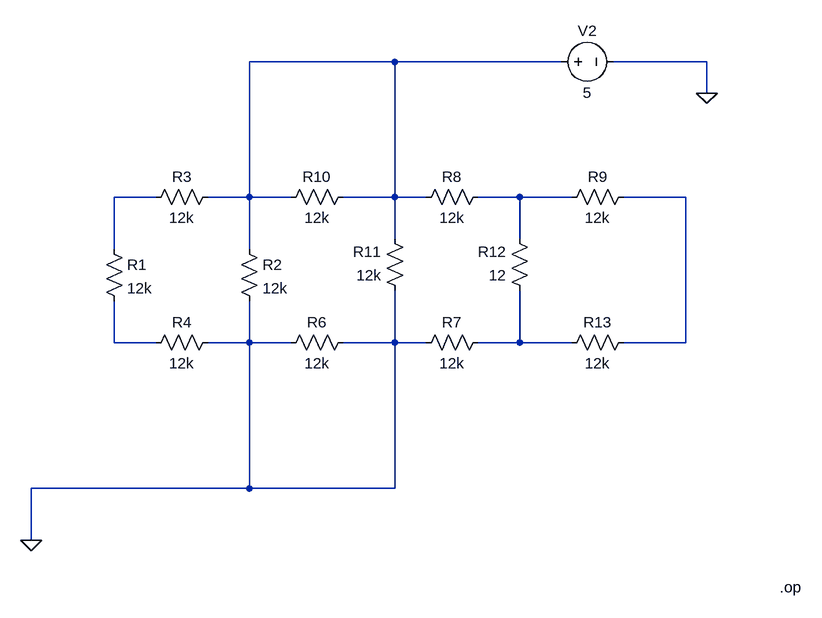
[diagram p0: schematic Experiment 0 Circuit Analysis.asc]
Experiment 0 Circuit Analysis.asc, the LTspice schematic file:
Version 4
SHEET 1 2708 808
WIRE 688 -16 464 -16
WIRE 944 -16 688 -16
WIRE 1168 -16 1024 -16
WIRE 1168 32 1168 -16
WIRE 320 192 256 192
WIRE 464 192 464 -16
WIRE 464 192 400 192
WIRE 528 192 464 192
WIRE 688 192 688 -16
WIRE 688 192 608 192
WIRE 736 192 688 192
WIRE 880 192 816 192
WIRE 960 192 880 192
WIRE 1136 192 1040 192
WIRE 688 256 688 192
WIRE 880 256 880 192
WIRE 256 272 256 192
WIRE 464 272 464 192
WIRE 256 416 256 352
WIRE 320 416 256 416
WIRE 464 416 464 352
WIRE 464 416 400 416
WIRE 528 416 464 416
WIRE 688 416 688 336
WIRE 688 416 608 416
WIRE 736 416 688 416
WIRE 880 416 880 336
WIRE 880 416 816 416
WIRE 960 416 880 416
WIRE 1136 416 1136 192
WIRE 1136 416 1040 416
WIRE 464 640 464 416
WIRE 464 640 128 640
WIRE 688 640 688 416
WIRE 688 640 464 640
WIRE 128 720 128 640
FLAG 1168 32 0
FLAG 128 720 0
SYMBOL res 240 256 R0
SYMATTR InstName R1
SYMATTR Value 12k
SYMBOL res 448 256 R0
SYMATTR InstName R2
SYMATTR Value 12k
SYMBOL res 416 176 R90
WINDOW 0 0 56 VBottom 2
WINDOW 3 32 56 VTop 2
SYMATTR InstName R3
SYMATTR Value 12k
SYMBOL res 416 400 R90
WINDOW 0 0 56 VBottom 2
WINDOW 3 32 56 VTop 2
SYMATTR InstName R4
SYMATTR Value 12k
SYMBOL res 624 400 R90
WINDOW 0 0 56 VBottom 2
WINDOW 3 32 56 VTop 2
SYMATTR InstName R6
SYMATTR Value 12k
SYMBOL res 832 400 R90
WINDOW 0 0 56 VBottom 2
WINDOW 3 32 56 VTop 2
SYMATTR InstName R7
SYMATTR Value 12k
SYMBOL res 832 176 R90
WINDOW 0 0 56 VBottom 2
WINDOW 3 32 56 VTop 2
SYMATTR InstName R8
SYMATTR Value 12k
SYMBOL res 1056 176 R90
WINDOW 0 0 56 VBottom 2
WINDOW 3 32 56 VTop 2
SYMATTR InstName R9
SYMATTR Value 12k
SYMBOL res 624 176 R90
WINDOW 0 0 56 VBottom 2
WINDOW 3 32 56 VTop 2
SYMATTR InstName R10
SYMATTR Value 12k
SYMBOL res 704 352 R180
WINDOW 0 36 76 Left 2
WINDOW 3 36 40 Left 2
SYMATTR InstName R11
SYMATTR Value 12k
SYMBOL res 896 352 R180
WINDOW 0 36 76 Left 2
WINDOW 3 36 40 Left 2
SYMATTR InstName R12
SYMATTR Value 12
SYMBOL res 944 432 R270
WINDOW 0 32 56 VTop 2
WINDOW 3 0 56 VBottom 2
SYMATTR InstName R13
SYMATTR Value 12k
SYMBOL voltage 928 -16 R270
WINDOW 0 32 56 VTop 2
WINDOW 3 -32 56 VBottom 2
SYMATTR InstName V2
SYMATTR Value 5
TEXT 1280 792 Left 2 !.op

The netlist it stands for:
* Experiment 0 Circuit Analysis.asc
R1 N002 N005 12k
R2 N001 0 12k
R3 N001 N002 12k
R4 0 N005 12k
R6 0 0 12k
R7 N006 0 12k
R8 N003 N001 12k
R9 N004 N003 12k
R10 N001 N001 12k
R11 0 N001 12k
R12 N006 N003 12
R13 N006 N004 12k
V2 N001 0 5
.op
.backanno
.end